# Altium schematic sheet PFC.SchDoc
size 431 x 279 mm; MPS_ProjectReference: B005; MPS_ProjectName: 230W E-Bike Charger; MPS_Enginieer: Oriol Cos; MPS_Drawn by: -; MPS_Review: v1.2; MPS_SheetNumber: 2; MPS_SheetTotal: 4; MPS_Designed For: Public Reference Design; MPS_Contact: www.monolithicpower.com; Organization: ORGANIZATION; Address1: ADDRESS 1; Address2: ADDRESS 2; Address3: ADDRESS 3; Address4: ADDRESS 4; Revision: -; ENG_APP_DATE: --/--/--; DSN_APP_DATE: --/--/--; CHK_APP_DATE: --/--/--
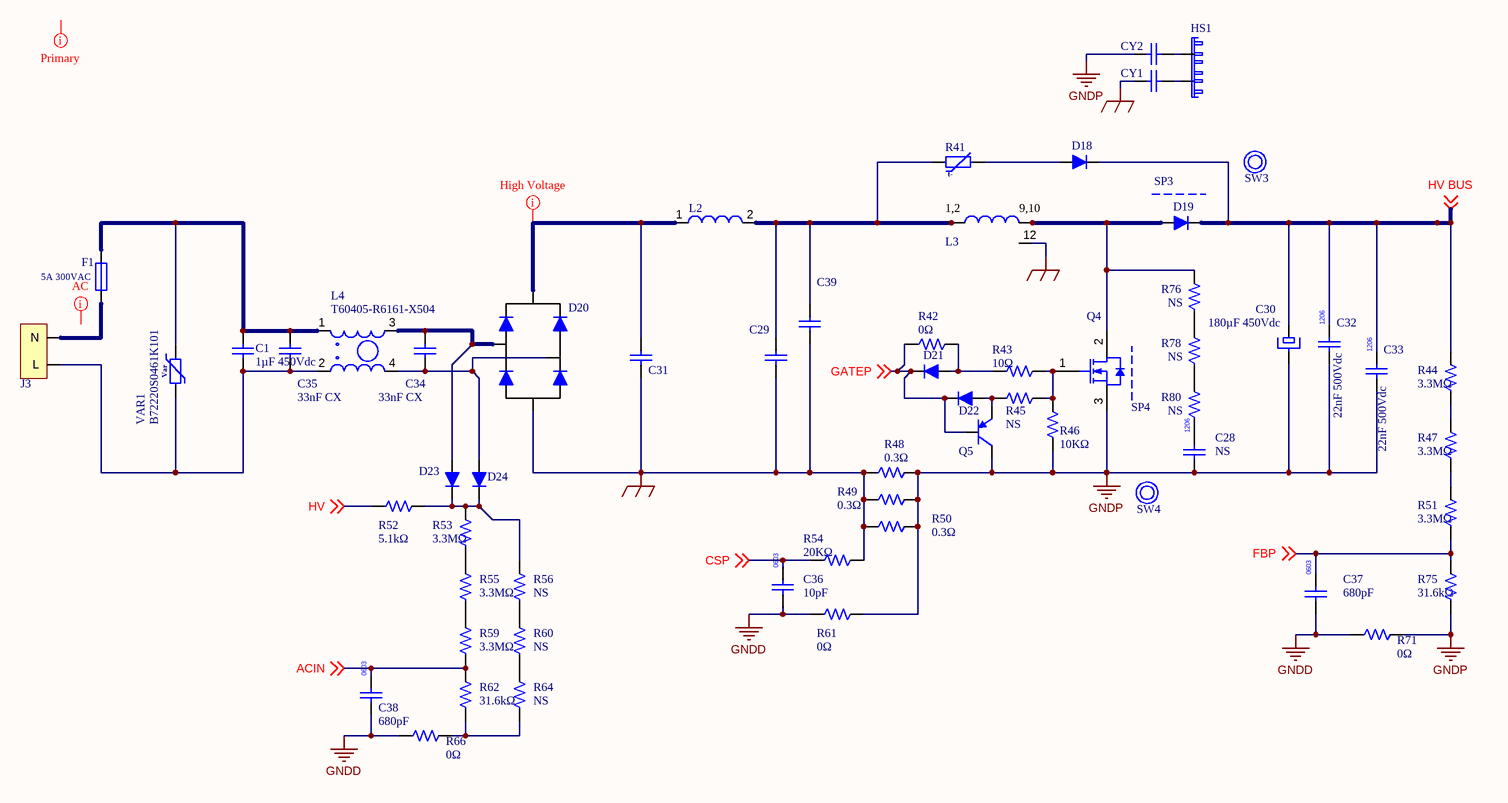
[diagram p0: PFC.SchDoc]

## Parts
C1  value 1µF 450Vdc  [17.5x8.5x15 mm - Doble]  (hidden comment: Capacitor_17.5x8.5x15 r15mm_Doble)
C28  value NS  [CC/NM 1206]  (hidden comment: Capacitor 22nF)
C29  (no value)  [TF684K2Y10BL270D9R]
C30  value 180µF 450Vdc  [CER30x30]
C31  (no value)  [TF684K2Y10BL270D9R]
C32  value 22nF 500Vdc  [CC/NM 1206]
C33  value 22nF 500Vdc  [CC/NM 1206]
C34  value 33nF CX  [POL 10.3x5x10.5 R7.5]  (hidden comment: MKS4J023302E00KSSD)
C35  value 33nF CX  [POL 10.3x5x10.5 R7.5]  (hidden comment: MKS4J023302E00KSSD)
C36  value 10pF  [CC/NM 0603]
C37  value 680pF  [CC/NM 0603]
C38  value 680pF  [CC/NM 0603]
C39  (no value)  [17.5x8.5x15 mm]
CY1  (no value)  [C_Y_r10mm (2)]
CY2  (no value)  [C_Y_r10mm (2)]
D18  (no value)  [DO-214AC]
D19  (no value)  [TO-220AC]
D20  (no value)  [GBU4L]
D21  (no value)  [SODFL260X90-2N]
D22  (no value)  [SODFL260X90-2N]
D23  (no value)  [DIOMELF3516N]
D24  (no value)  [DIOMELF3516N]
F1  value 5A 300VAC  [FUSE]
HS1  (no value)  [HS1]
J3  (no value)  [RAPC322X]
L2  (no value)  [O 25x10]
L3  (no value)  [PQ 32/30]
L4  T60405-R6161-X504  [T60405-R6161-X504]
Q4  (no value)  [TO-220 Shifted]
Q5  (no value)  [SOT95P237X112-3N]
R41  (no value)  [NTC D2-10]
R42  value 0Ω  [CC/NM 0603]
R43  value 10Ω  [CC/NM 0603]
R44  value 3.3MΩ  [CC/NM 1206]
R45  value NS  [CC/NM 0603]
R46  value 10KΩ  [CC/NM 0603]
R47  value 3.3MΩ  [CC/NM 1206]
R48  value 0.3Ω  [CC/NM 2512]
R49  value 0.3Ω  [CC/NM 2512]
R50  value 0.3Ω  [CC/NM 2512]
R51  value 3.3MΩ  [CC/NM 1206]
R52  value 5.1kΩ  [CC/NM 1206]
R53  value 3.3MΩ  [CC/NM 1206]
R54  value 20KΩ  [CC/NM 0603]  (hidden comment: Resistor 20K)
R55  value 3.3MΩ  [CC/NM 1206]
R56  value NS  [CC/NM 1206]
R59  value 3.3MΩ  [CC/NM 1206]
R60  value NS  [CC/NM 1206]
R61  value 0Ω  [CC/NM 0603]
R62  value 31.6kΩ  [CC/NM 0603]  (hidden comment: Resistor 1K)
R64  value NS  [CC/NM 1206]
R66  value 0Ω  [CC/NM 0603]
R71  value 0Ω  [CC/NM 0603]
R75  value 31.6kΩ  [CC/NM 0603]
R76  value NS  [CC/NM 1206]  (hidden comment: Resistor 4.7)
R78  value NS  [CC/NM 1206]  (hidden comment: Resistor 4.7)
R80  value NS  [CC/NM 1206]  (hidden comment: Resistor 4.7)
SP3  SIL-PAD TO-220  (value not drawn)
SP4  SIL-PAD TO-220  (value not drawn)
SW3  Shoulder Washer M2.5  (value not drawn)
SW4  Shoulder Washer M2.5  (value not drawn)
VAR1  B72220S0461K101  [Var 10mm]

## Nets
EARTH: C29.2 C31.2 C39.2 CY1.1 D20.4(-) L3.12 R48.1 R49.1 R50.1 R54.2
GNDD: C36.2 C37.2 C38.2 R61.1 R66.1 R71.1
GNDP: C28.2 C30.2 C32.2 C33.2 CY2.1 Q4.3(SOURCE) Q5.3(C) R46.1 R48.2 R49.2 R50.2 R61.2 R71.2 R75.1
ACIN: C38.1 R59.1 R62.2 ; off-sheet ACIN
CSP: C36.1 R54.1 ; off-sheet CSP
FBP: C37.1 R51.1 R75.2 ; off-sheet FBP
GATEP: D21.1 D22.1 Q5.1(B) R42.1 ; off-sheet GATEP
HV: R52.1 ; off-sheet HV
HV BUS: C30.1 C32.1 C33.1 D18.1 D19.1(K) R44.2 ; off-sheet HV BUS
NetC1_1: C1.1 C35.2 J3.1(L) L4.2 VAR1.1
NetC1_2: C1.2 C1.3 C35.1 F1.1 L4.1 VAR1.2
NetC28_1: C28.1 R80.1
NetC29_1: C29.1 C39.1 L2.2 L3.1 L3.2 R41.1
NetC31_1: C31.1 D20.1(+) L2.1
NetC34_1: C34.1 D20.3(AC) D23.2 L4.3
NetC34_2: C34.2 D20.2(AC) D24.2 L4.4
NetCY1_2: CY1.2 HS1.0
NetCY2_2: CY2.2 HS1.1
NetD18_2: D18.2 R41.2
NetD19_2: D19.2(A) L3.9 L3.10 Q4.2(DRAIN) R76.2
NetD21_2: D21.2 R42.2 R43.1
NetD22_2: D22.2 Q5.2(E) R45.1
NetD23_1: D23.1 D24.1 R52.2 R53.2 R56.2
NetF1_2: F1.2 J3.2(N)
NetQ4_1: Q4.1(GATE) R43.2 R45.2 R46.2
NetR44_1: R44.1 R47.2
NetR47_1: R47.1 R51.2
NetR53_1: R53.1 R55.2
NetR55_1: R55.1 R59.2
NetR56_1: R56.1 R60.2
NetR60_1: R60.1 R64.2
NetR62_1: R62.1 R64.1 R66.2
NetR76_1: R76.1 R78.2
NetR78_1: R78.1 R80.2

## Layout directives
net class HighVoltage: NetC31_1
net class Primary: (no net found under the mark)
net class AC: (no net found under the mark)

## Notes on the sheet
- DWG. NO.
- REV.
- SHT.
- THIS DOCUMENT AND THE DATA DISCLOSED HEREIN OR HEREWITH IS THE PROPERTY OF ALTIUM LIMITED AND MAY BE FREELY DISTRIBUTED IN WHOLE. NO RIGHTS ARE RESERVED OR EXPRESS OR IMPLIED WARANTEE GIVEN.
- REVISION
- DESCRIPTION
- DATE
- APPROVED
- ENG:
- APPROVALS
- PROJECT
- DSN:
- CHK:
- REFERENCE DOCUMENTS
- PROJECT REVISION:
- TITLE
- DOCUMENT REVISION:
- DESIGN ITEM:
- BOM:
- FAB DWG:
- PCB DWG:
- ASSY DWG:
- SCALE:
- SIZE
- B
- CAGE CODE
- FILE NAME
- DWG NO.
- SHEET
- OF
- REV
- (in symbol B72220S0461K101) Var
- (in symbol Inductor_PQ32/30) 1,2; 9,10
- (in symbol SL22 2R018) t-

## Library data of the parts
C1 = Capacitor_17.5x8.5x15 r15mm_Doble: Manufacturer 1: Panasonic; Manufacturer Part Number 1: ECQ-E2W105KH; Datasheet: https://www.mouser.es/datasheet/2/315/Panasonic_11102016_ECQE(H)-1196907.pdf; Package: r15 18x8; Supplier 1: Mouser; Price 1k Ud.: 0.2; Supplier Part Number 1: 667-ECQ-E2W105KH
C28 = Capacitor 22nF: 22nF; Datasheet: *; Supplier 1: -; Supplier 2: *; Package: 1206; Voltage: *; Price 1k Ud.: 0.01; Supplier Part Number 1: -; Manufacturer 1: -; Manufacturer Part Number 1: NS
C29 C31 = TF684K2Y10BL270D9R: Manufacturer 1: CARLI; Value: 680nF 450Vdc; Package: r1 1.1x0.8; Supplier 1: -; Price 1k Ud.: 0.2; Supplier Part Number 1: -; Manufacturer Part Number 1: TF684K2Y10BL270D9R
C30 = Capacitor_30x30 r10: Manufacturer 1: KEMET; Manufacturer Part Number 1: ELG187M450AS3AA; Package: r10 d30; Supplier 1: Farnell; Price 1k Ud.: 1.97; Supplier Part Number 1: 2476248
C32 C33 = Capacitor 22nF: 22nF; Manufacturer 1: KEMET; Manufacturer Part Number 1: C1206V223KCRACTU; Datasheet: *; Supplier 1: Farnell; Supplier 2: *; Package: 1206; Price 1k Ud.: 0.01; Supplier Part Number 1: 2085193
C34 C35 = Capacitor_10.3x5x10.5 r7.5mm: Manufacturer 1: WIMA; Datasheet: https://www.mouser.es/datasheet/2/440/e_WIMA_MKS_4-1139797.pdf; Package: r7.5 10.3x5; Supplier 1: Mouser; Price 1k Ud.: 0.2; Supplier Part Number 1: 505-MKS4.033/630/10; Manufacturer Part Number 1: MKS4J023302E00KSSD
C36 = Capacitor 220pF: 10pF; Manufacturer Part Number 1: 0603 10pF; Datasheet: *; Supplier 1: -; Supplier 2: *; Package: 0603; Price 1k Ud.: 0.01; Supplier Part Number 1: -; Manufacturer 1: -
C37 C38 = Capacitor 680pF: 680pF; Manufacturer Part Number 1: 0603 680pF; Datasheet: *; Supplier 1: *; Supplier 2: *; Package: 0603; Price 1k Ud.: 0.01; Manufacturer 1: -
C39 = Capacitor_17.5x8.5x15 r15mm: Manufacturer 1: Kemet; Manufacturer Part Number 1: R463I310050M1K; Value: 0.1 µF 630Vdc; Datasheet: https://www.mouser.es/datasheet/2/212/KEM_F3103_R60-1103089.pdf; Package: r15 18x5; Supplier 1: Mouser; Price 1k Ud.: 0.2; Supplier Part Number 1: 80-R463I310050M1K
CY1 = Capacitor_Y_r10 (2): Manufacturer 1: Murata; Manufacturer Part Number 1: DE1E3RA222MN4AN01F; Value: 2.2nF CY; Package: r10; Supplier 1: Mouser; Price 1k Ud.: 0.10; Supplier Part Number 1: 81-DE1E3RA222MN4AN1F
CY2 = Capacitor_Y_r10 (2): Value: NS; Price 1k Ud.: 0; Manufacturer Part Number 1: NS
D18 = RS1J: Fast Rectifier 600 V, 1 A, 1.3 V, 250 ns, 30 A; Manufacturer 1: ON SEMICONDUCTOR; Value: 600V 1A; Datasheet: http://www.farnell.com/datasheets/2287956.pdf?_ga=2.70890960.1791824414.1527067450-1671032910.1525848716&_gac=1.117240180.1526460935.Cj0KCQjwre_XBRDVARIsAPf7zZjUOU5-0pyrhwYQ09aPTHihSScNp-g0ngVZM5yZ5xu5MR-Mht2cpfEaAsncEALw_wcB; Supplier 1: Farnell; Supplier 2: *; Package: DO-214AC; Price 1k Ud.: 0.01; Supplier Part Number 1: 2454084; Manufacturer Part Number 1: RS1J
D19 = QH08TZ600: 600 V, 8 A H-Series PFC Diode; Manufacturer 1: POWER INTEGRATIONS; Value: 600V 8A; Datasheet: http://www.farnell.com/datasheets/2328148.pdf?_ga=2.264852047.1791824414.1527067450-1671032910.1525848716&_gac=1.216338788.1526460935.Cj0KCQjwre_XBRDVARIsAPf7zZjUOU5-0pyrhwYQ09aPTHihSScNp-g0ngVZM5yZ5xu5MR-Mht2cpfEaAsncEALw_wcB; Supplier 1: Farnell; Supplier 2: *; Package: TO-220AC; Price 1k Ud.: 0.01; Supplier Part Number 1: 2771812; Manufacturer Part Number 1: QH08TZ600
D20 = Bridge_Rectifier: Rectifier Diode, 600 V, 8 A, SIP, 1 V, 4 Pins; Manufacturer 1: On Semiconductor; Manufacturer Part Number 1: GBU8J; Value: 600V 8A; Supplier 1: Farnell; Package: GBU8L; Datasheet: http://www.farnell.com/datasheets/2304054.pdf?_ga=2.260545613.1574210650.1526985275-1776635558.1522923271&_gac=1.116606324.1526985275.CjwKCAjw_47YBRBxEiwAYuKdww9b6sMrV3bL46mkZpXa3C9ombUFUaiop7L4r4spXLG7BMEaHASa6xoCLfwQAvD_BwE; Price 1k Ud.: 0.682; Supplier Part Number 1: 1017705
D21 D22 = 1N4148WS: 1N4148  miniMelf Series 500 mW 100 V Max Reverse Voltage 200 mA Small Signal Diode -; Manufacturer 1: ON SEMICONDUCTOR; Value: NS; Datasheet: http://www.farnell.com/datasheets/2288055.pdf?_ga=2.37780835.1791824414.1527067450-1671032910.1525848716&_gac=1.116268276.1526460935.Cj0KCQjwre_XBRDVARIsAPf7zZjUOU5-0pyrhwYQ09aPTHihSScNp-g0ngVZM5yZ5xu5MR-Mht2cpfEaAsncEALw_wcB; Supplier 1: Farnell; Supplier 2: *; Package: SOD-323F; Price 1k Ud.: 0; Supplier Part Number 1: 2453269RL; Manufacturer Part Number 1: NS
D23 D24 = WSGC10DH: Manufacturer 1: ZOWIE; Value: 1000V 1A; Datasheet: http://www.alldatasheet.com/datasheet-pdf/pdf/489086/ZOWIE/WSGC10MH.html; Price 1k Ud.: 0.01; Manufacturer Part Number 1: WSGC10DH
F1 = SS-5H-5A-APH: Fuse,  PCB, 5 A, 300 VAC, Serie SS-5H.; Manufacturer 1: EATON BUSSMANN SERIES; Datasheet: http://www.farnell.com/datasheets/1966141.pdf?_ga=2.37867747.1791824414.1527067450-1671032910.1525848716&_gac=1.87763434.1527074352.CjwKCAjwopTYBRAzEiwAnU4kb6z-6FW-YcWql_Nz5Kz7fYgOmlLJCAal4t5nSo58EtdqtK8PVtIzURoCa2gQAvD_BwE; Supplier 1: Farnell; Price 1k Ud.: 0.601; Supplier Part Number 1: 2497566; Manufacturer Part Number 1: SS-5H-5A-APH
HS1 = HS1: Manufacturer 1: MonolithicPowerSystems; Value: HS1; Price 1k Ud.: 3.0; Manufacturer Part Number 1: HS1
J3 = Connector_AC: AC C8 Connector 250 V / 2.5 A; Manufacturer 1: Schurter; Value: 250V 2.5A; Datasheet: https://www.mouser.es/datasheet/2/393/RAPC322X_CD-479135.pdf; Package: Screw; Supplier 1: Mouser; Price 1k Ud.: 1.28; Supplier Part Number 1: 502-RAPC322X; Manufacturer Part Number 1: RAPC322X
L2 = Inductance_O 26-12: Manufacturer 1: Würth Elektronik; Manufacturer Part Number 1: 7447065; Value: 330µH 3.1A; Datasheet: https://katalog.we-online.de/pbs/datasheet/7447065.pdf; Package: 25x10; Price 1k Ud.: 2.5
L3 = Inductor_PQ32/30: Manufacturer 1: PROELEC; Manufacturer Part Number 1: 005-L3; Value: 260µH; Package: PQ32/30; Price 1k Ud.: 3.0
L4 = T60405-R6161-X504: CM Filter VAC 2x28.3mH@10kHz  5A; Value: 6.6mH 4.5A; Supplier 1: Mouser; Supplier Part Number 1: 983-T60405-R6161X504; Manufacturer 1: VAC; Manufacturer Part Number 1: T60405-R6161-X504
Q4 = IPP60R600C6XKSA1: 600V / 16A; Manufacturer 1: Infineon; Manufacturer Part Number 1: IPP65R660CFDXKSA1; Value: 650V 16A; Supplier 1: Farnell; Datasheet: http://www.farnell.com/datasheets/1900384.pdf?_ga=2.95452636.1791824414.1527067450-1671032910.1525848716&_gac=1.187305818.1527074352.CjwKCAjwopTYBRAzEiwAnU4kb6z-6FW-YcWql_Nz5Kz7fYgOmlLJCAal4t5nSo58EtdqtK8PVtIzURoCa2gQAvD_BwE; Package: TO-220AC; Price 1k Ud.: 0.559; Supplier Part Number 1: 1860820
Q5 = BJT_PNP_SOT23: Value: NS; Package: SOT-23-3; Price 1k Ud.: 0; Manufacturer Part Number 1: NS
R41 = SL22 2R018: Termistor, NTC ICL, 2 ohm, -20% a +20%, , Serie SL22; Manufacturer 1: AMETHERM; Value: 2Ω; Datasheet: http://www.farnell.com/datasheets/87332.pdf?_ga=2.103969344.1791824414.1527067450-1671032910.1525848716&_gac=1.194142815.1527074352.CjwKCAjwopTYBRAzEiwAnU4kb6z-6FW-YcWql_Nz5Kz7fYgOmlLJCAal4t5nSo58EtdqtK8PVtIzURoCa2gQAvD_BwE; Package: Disc 22mm; Supplier 1: Farnell; Price 1k Ud.: 1.0; Supplier Part Number 1: 1653455; Manufacturer Part Number 1: SL22 2R018
R42 R66 R71 = Resistor 0: Resistor 0603; Manufacturer Part Number 1: 0603; Supplier 1: *; Package: 0603; Datasheet: *
  R42 R71: Price 1k Ud.: 0.01
  R66: Price 1k Ud.: 0
R43 = Resistor 10: Resistor 0603; Manufacturer Part Number 1: 0603 10R; Supplier 1: *; Package: 0603; Datasheet: *; Price 1k Ud.: 0.01
R44 R47 R51 R53 R55 R59 = Resistor 3M3: Resistor 1206; Manufacturer Part Number 1: 1206 3M3; Supplier 1: *; Package: 1206; Datasheet: *; Price 1k Ud.: 0.01
R45 = Resistor 4.7: Resistor 0603; Supplier 1: *; Package: 0603; Datasheet: *; Price 1k Ud.: 0; Manufacturer Part Number 1: NS
R46 = Resistor 10K: Resistor 0603; Manufacturer Part Number 1: 0603 10K; Supplier 1: *; Package: 0603; Datasheet: *; Price 1k Ud.: 0.01
R48-R50 = Resistor 1: Resistor 2512; Manufacturer 1: MULTICOMP; Manufacturer Part Number 1: MCWW25XR300FTL; Supplier 1: Farnell; Package: 2512; Datasheet: *; Price 1k Ud.: 0.175; Supplier Part Number 1: 2696054
R52 = Resistor 5K1: Resistor 1206; Manufacturer Part Number 1: 1206 5K1; Supplier 1: *; Package: 1206; Datasheet: *; Price 1k Ud.: 0.01
R54 = Resistor 20K: Resistor 0603; Manufacturer Part Number 1: 0603 20K; Supplier 1: *; Package: 0603; Datasheet: *; Price 1k Ud.: 0.01
R56 R60 R64 = Resistor 3M3: Resistor 1206; Supplier 1: *; Package: 1206; Datasheet: *; Price 1k Ud.: 0; Manufacturer Part Number 1: NS
R61 = Resistor 1K: Resistor 0603; Manufacturer Part Number 1: 0603; Supplier 1: *; Package: 0603; Datasheet: *; Price 1k Ud.: 0.01
R62 R75 = Resistor 31K6: Resistor 0603; Manufacturer Part Number 1: 0603 31K6; Supplier 1: *; Package: 0603; Datasheet: *; Price 1k Ud.: 0.01
R76 R78 R80 = Resistor 4.7: Resistor 1206; Supplier 1: *; Package: 1206; Datasheet: *; Price 1k Ud.: 0.01; Manufacturer Part Number 1: NS
SP3 SP4 = SIL-PAD TO-220: Sil-Pad 2000 es un aislador de conducción térmica de alto rendimiento diseñado para aplicaciones exigentes de tipo militar / aeroespacial y comercial. Sil-Pad 2000 cumple con: MIL-M-38527/8A, MIL-M-38527C y MIL-I-49456. / Fiabilidad y rendimiento óptimos / Aislamiento eléctrico de 4kV (mínimo) / Limpio, sin grasa y flexible / Elastómero de silicona cargado de nitruro de boro / Pre-cortado para transistores, o en lámina no cortada; Manufacturer 1: BERGQUIST; Manufacturer Part Number 1: 2015-54; Value: 3.5W/m.K 4kV; Datasheet: http://www.farnell.com/datasheets/49499.pdf?_ga=2.194756708.870501412.1538985677-1776635558.1522923271; Package: TO-220; Supplier 1: Farnell; Supplier Part Number 1: 681118
SW3 SW4 = Shoulder Washer M2.5: Manufacturer 1: Keystone; Manufacturer Part Number 1: 3103; Value: M2; Datasheet: https://www.mouser.es/datasheet/2/215/103-744481.pdf; Package: M2; Supplier 1: Mouser; Supplier Part Number 1: 534-3103
VAR1 = B72220S0461K101: Varistor  (TVS), 460 V, 615 V, Serial B722, 1240 V, Disc 20mm; Manufacturer 1: EPCOS; Value: -; Datasheet: http://www.farnell.com/datasheets/2015602.pdf?_ga=2.3920112.1791824414.1527067450-1671032910.1525848716&_gac=1.84110699.1527074352.CjwKCAjwopTYBRAzEiwAnU4kb6z-6FW-YcWql_Nz5Kz7fYgOmlLJCAal4t5nSo58EtdqtK8PVtIzURoCa2gQAvD_BwE; Package: Disc 20mm; Supplier 1: Farnell; Supplier Part Number 1: 1004272; Manufacturer Part Number 1: B72220S0461K101